# EAGLE schematic arduino_olfactometer (EAGLE 5.11)

## Sheet 1 of 4
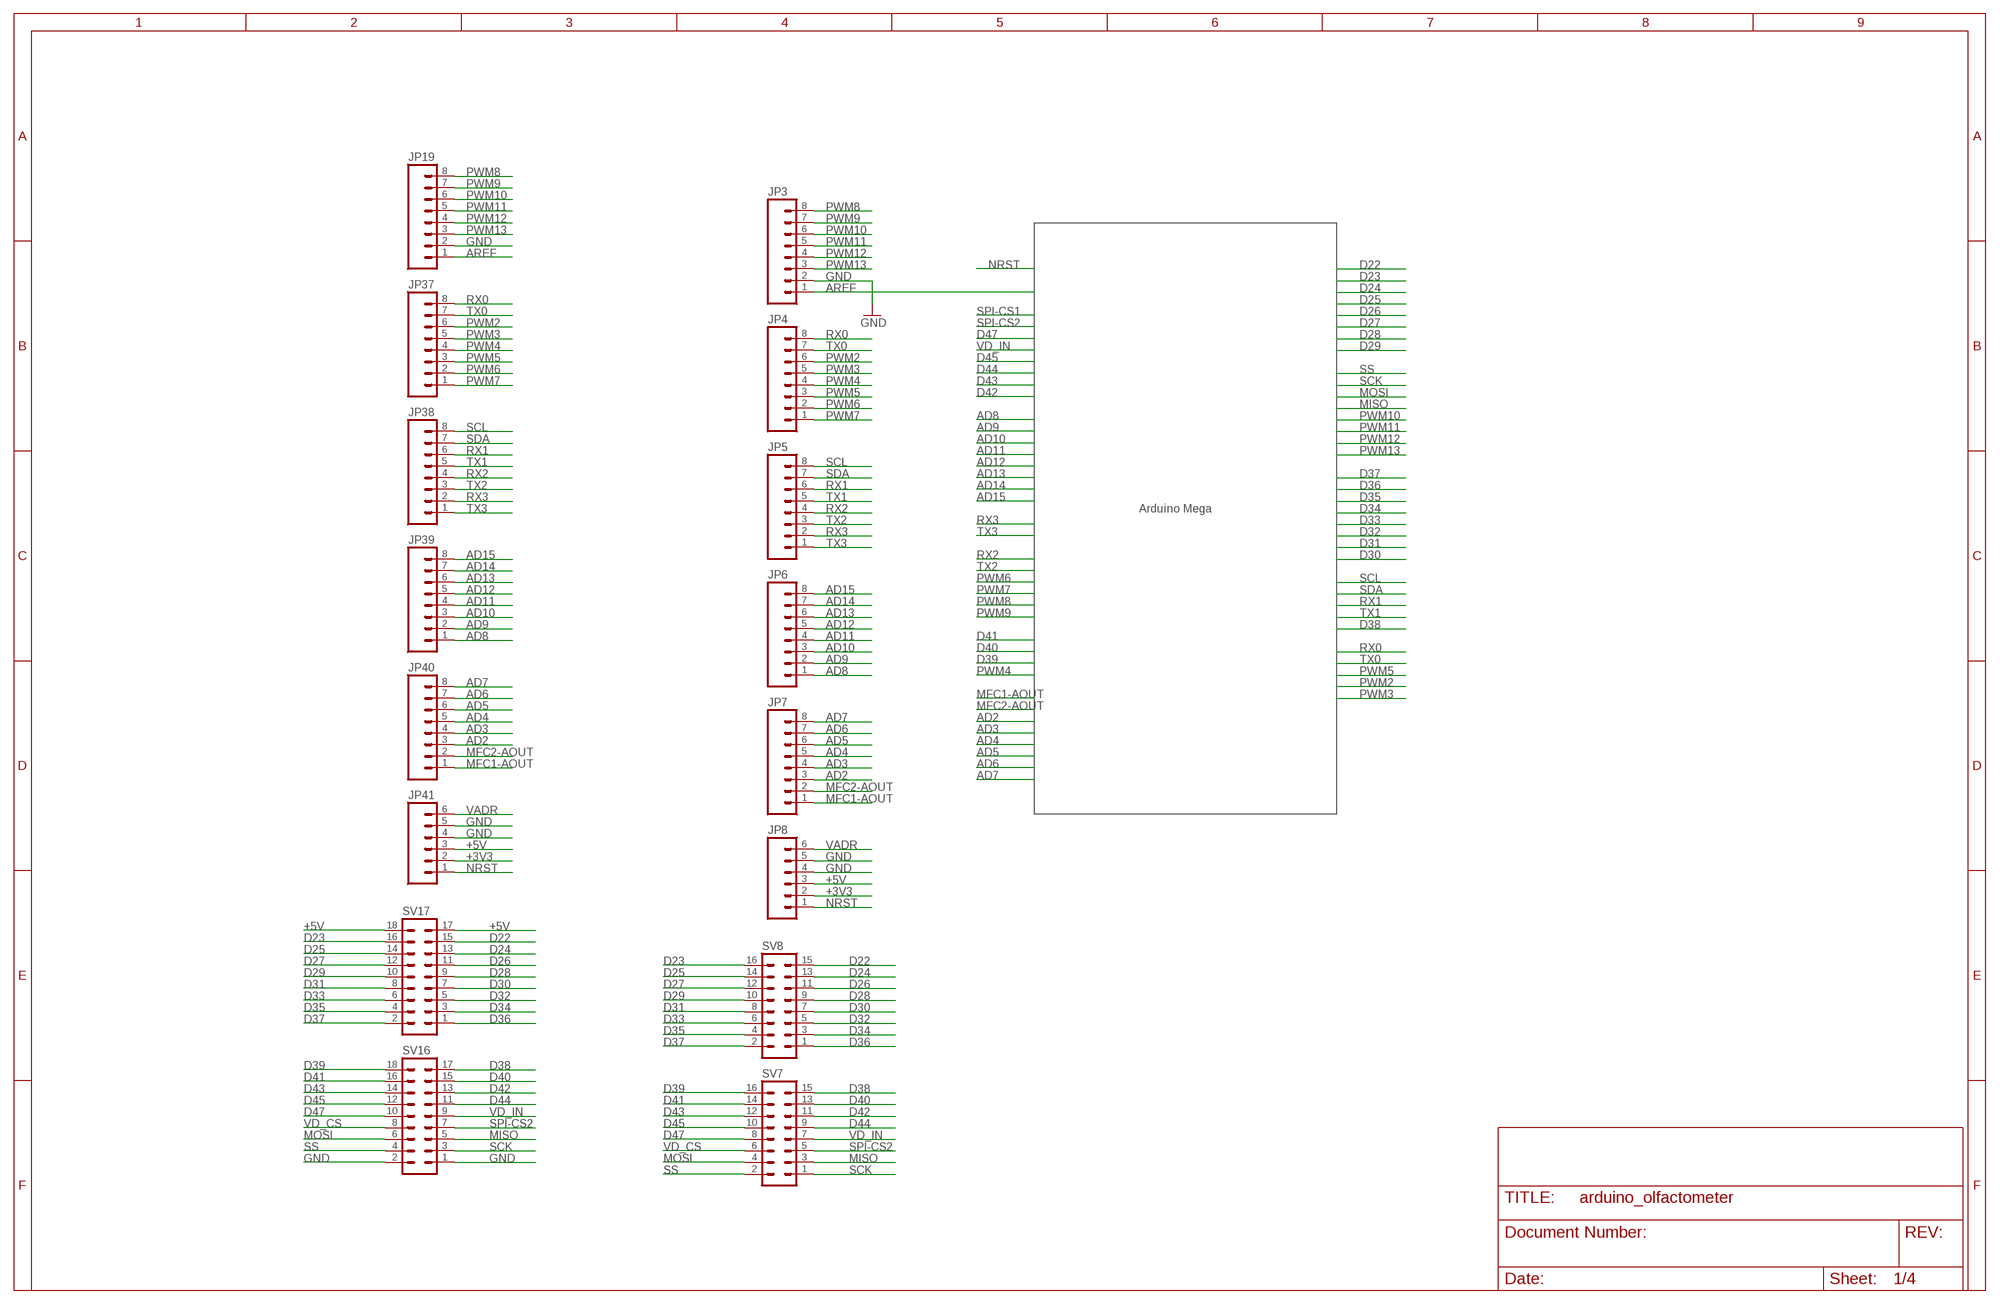
[diagram p0: schematic, sheet 1]

### Parts
JP3  M08  [1X08]
JP4  M08  [1X08]
JP5  M08  [1X08]
JP6  M08  [1X08]
JP7  M08  [1X08]
JP8  M06SIP  [1X06]
JP19  M08  [1X08]
JP37  M08  [1X08]
JP38  M08  [1X08]
JP39  M08  [1X08]
JP40  M08  [1X08]
JP41  M06SIP  [1X06]
SV7  MA08-2  [MA08-2]
SV8  MA08-2  [MA08-2]
SV16  MA09-2  [MA09-2]
SV17  MA09-2  [MA09-2]

### Nets
+3V3: JP8.2 JP41.2
+5V: JP8.3 JP41.3 SV17.17 SV17.18 ; also sheet 2,3,4
AD2: JP7.3 JP40.3
AD3: JP7.4 JP40.4
AD4: JP7.5 JP40.5
AD5: JP7.6 JP40.6
AD6: JP7.7 JP40.7
AD7: JP7.8 JP40.8
AD8: JP6.1 JP39.1
AD9: JP6.2 JP39.2
AD10: JP6.3 JP39.3
AD11: JP6.4 JP39.4
AD12: JP6.5 JP39.5
AD13: JP6.6 JP39.6
AD14: JP6.7 JP39.7
AD15: JP6.8 JP39.8
AREF: JP3.1 JP19.1
D22: SV8.15 SV17.15
D23: SV8.16 SV17.16
D24: SV8.13 SV17.13
D25: SV8.14 SV17.14
D26: SV8.11 SV17.11
D27: SV8.12 SV17.12
D28: SV8.9 SV17.9
D29: SV8.10 SV17.10
D30: SV8.7 SV17.7
D31: SV8.8 SV17.8
D32: SV8.5 SV17.5
D33: SV8.6 SV17.6
D34: SV8.3 SV17.3
D35: SV8.4 SV17.4
D36: SV8.1 SV17.1
D37: SV8.2 SV17.2
D38: SV7.15 SV16.17
D39: SV7.16 SV16.18
D40: SV7.13 SV16.15
D41: SV7.14 SV16.16
D42: SV7.11 SV16.13
D43: SV7.12 SV16.14
D44: SV7.9 SV16.11
D45: SV7.10 SV16.12
D47: SV7.8 SV16.10
GND: JP3.2 JP8.4 JP8.5 JP19.2 JP41.4 JP41.5 SV16.1 SV16.2 ; also sheet 2,3,4
MFC1-AOUT: JP7.1 JP40.1 ; also sheet 2
MFC2-AOUT: JP7.2 JP40.2 ; also sheet 2
MISO: SV7.3 SV16.5 ; also sheet 2,4
MOSI: SV7.4 SV16.6 ; also sheet 2,3
NRST: JP8.1 JP41.1 ; also sheet 3,4
PWM2: JP4.6 JP37.6 ; also sheet 2
PWM3: JP4.5 JP37.5 ; also sheet 2
PWM4: JP4.4 JP37.4 ; also sheet 2
PWM5: JP4.3 JP37.3 ; also sheet 2
PWM6: JP4.2 JP37.2 ; also sheet 2
PWM7: JP4.1 JP37.1 ; also sheet 2
PWM8: JP3.8 JP19.8 ; also sheet 2
PWM9: JP3.7 JP19.7 ; also sheet 2
PWM10: JP3.6 JP19.6 ; also sheet 2
PWM11: JP3.5 JP19.5 ; also sheet 2
PWM12: JP3.4 JP19.4 ; also sheet 2
PWM13: JP3.3 JP19.3 ; also sheet 2
RX0: JP4.8 JP37.8
RX1: JP5.6 JP38.6 ; also sheet 2
RX2: JP5.4 JP38.4 ; also sheet 2
RX3: JP5.2 JP38.2 ; also sheet 2
SCK: SV7.1 SV16.3 ; also sheet 2,3,4
SCL: JP5.8 JP38.8
SDA: JP5.7 JP38.7
SPI-CS2: SV7.5 SV16.7
SS: SV7.2 SV16.4 ; also sheet 2
TX0: JP4.7 JP37.7
TX1: JP5.5 JP38.5 ; also sheet 2
TX2: JP5.3 JP38.3 ; also sheet 2
TX3: JP5.1 JP38.1 ; also sheet 2
VADR: JP8.6 JP41.6 ; also sheet 2
VD_CS: SV7.6 SV16.8 ; also sheet 3,4
VD_IN: SV7.7 SV16.9 ; also sheet 3,4

### Notes on the sheet
- Arduino Mega

## Sheet 2 of 4
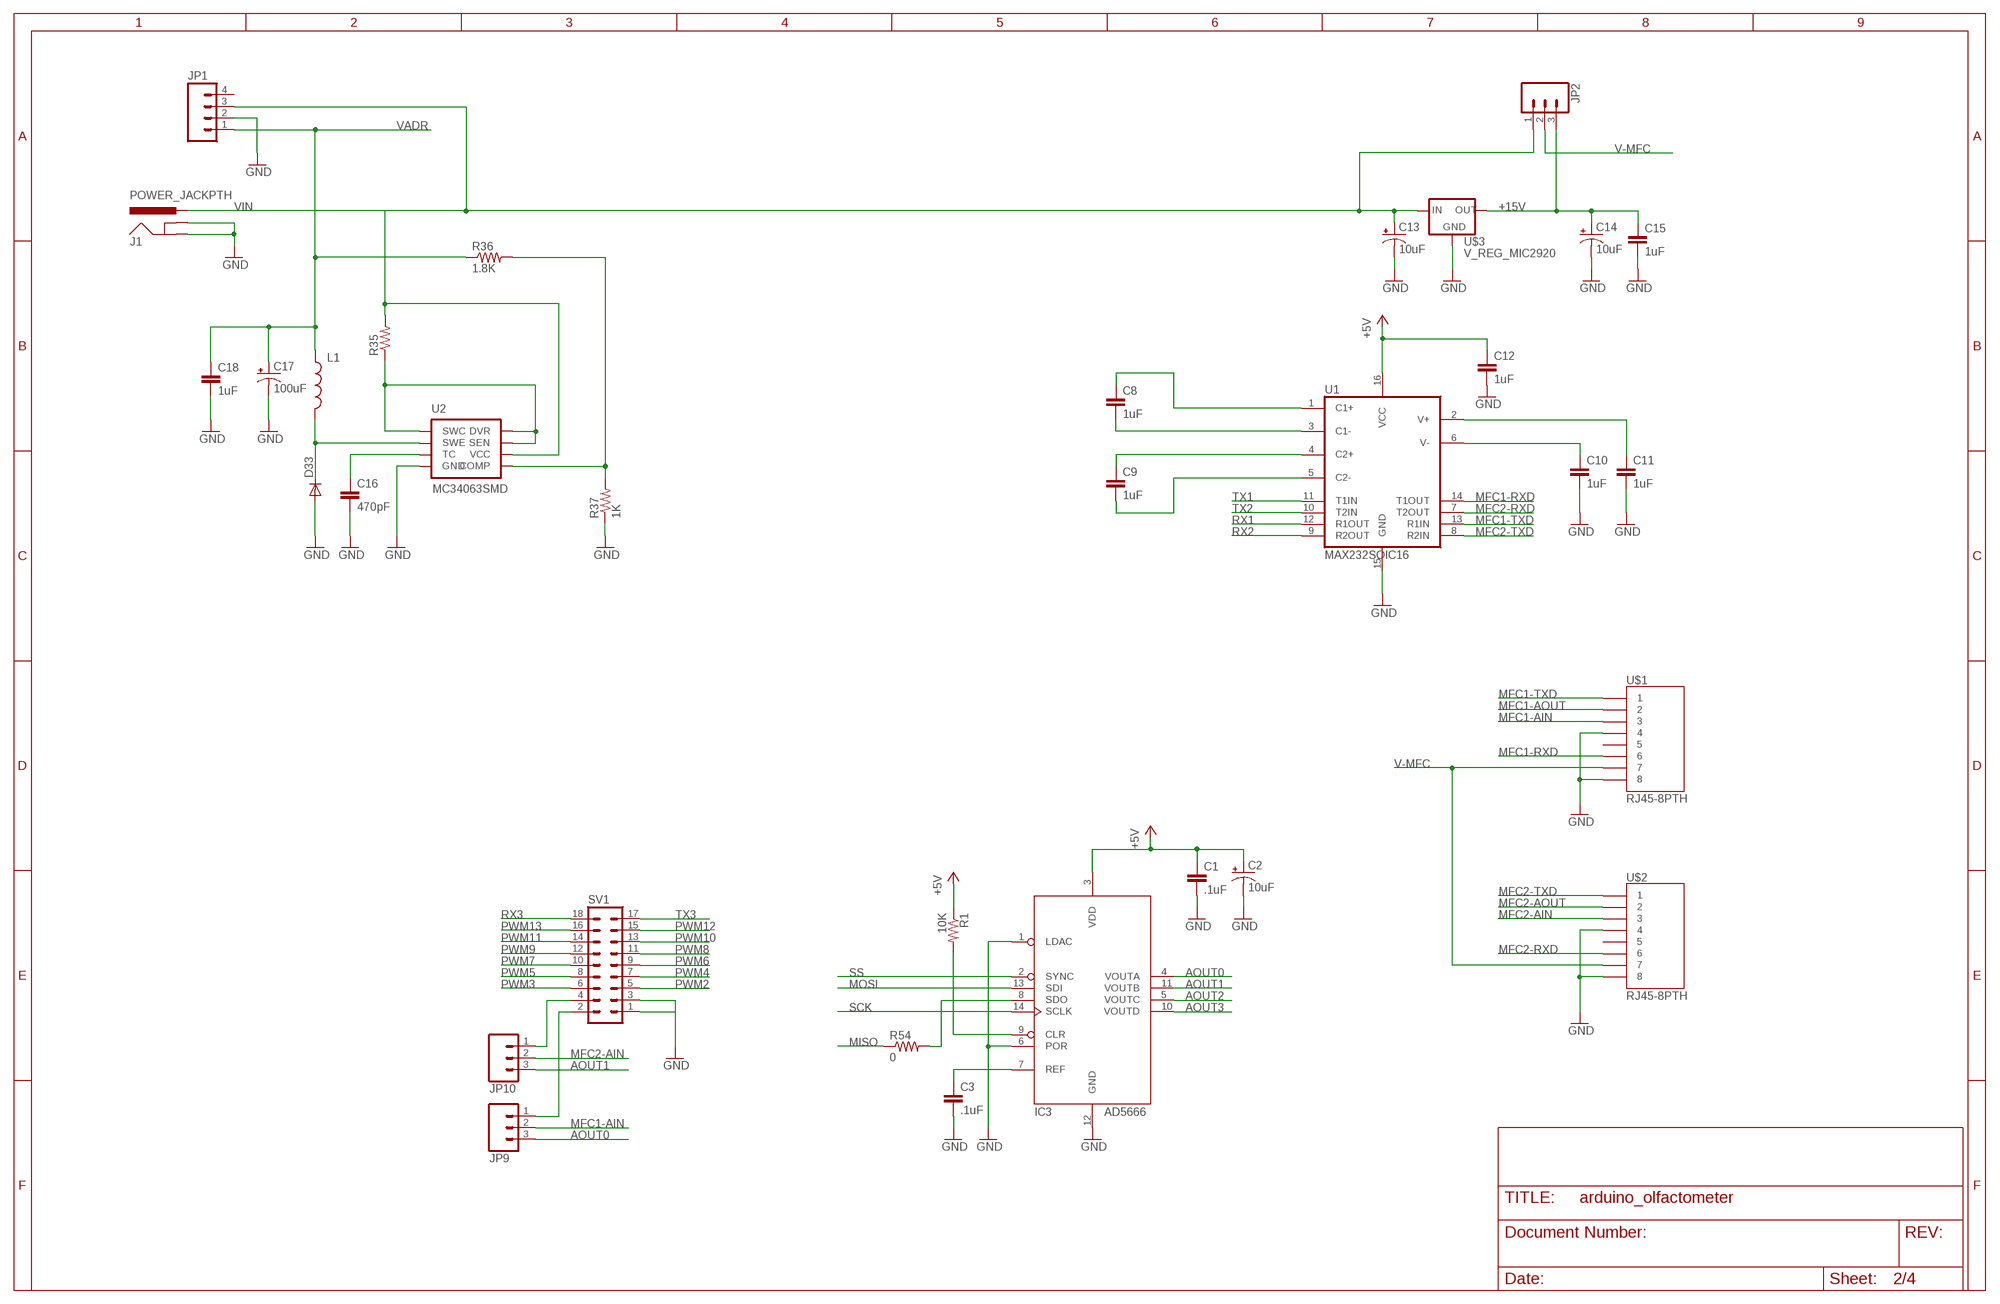
[diagram p1: schematic, sheet 2]

### Parts
C1  .1uF  CAP0603  [0603]
C2  10uF  CAP_POL1206  [EIA3216]
C3  .1uF  CAP0603  [0603]
C8  1uF  CAP0603  [0603]
C9  1uF  CAP0603  [0603]
C10  1uF  CAP0603  [0603]
C11  1uF  CAP0603  [0603]
C12  1uF  CAP0603  [0603]
C13  10uF  CAP_POL1206  [EIA3216]
C14  10uF  CAP_POL1206  [EIA3216]
C15  1uF  CAP0603  [0603]
C16  470pF  CAP0603  [0603]
C17  100uF  CAP_POLD  [PANASONIC_D]
C18  1uF  CAP0603  [0603]
D33  DIODE-SOD123  [SOD123]
IC3  AD5666  [TSSOP14]
J1  POWER_JACKPTH  [POWER_JACK_PTH]
JP1  M04PTH  [1X04]
JP2  M03PTH  [1X03]
JP9  M03PTH  [1X03]
JP10  M03PTH  [1X03]
L1  INDUCTORCR54  [CR54]
R1  10K  RESISTOR  [0805]
R35  RESISTOR  [0805]
R36  1.8K  RESISTOR  [0805]
R37  1K  RESISTOR  [0805]
R54  0  RESISTOR  [0805]
SV1  MA09-2  [MA09-2]
U1  MAX232SOIC16  [SO016]
U2  MC34063SMD  [SO08]
U$1  RJ45-8PTH  [RJ45-8]
U$2  RJ45-8PTH  [RJ45-8]
U$3  V_REG_MIC2920  [SOT223]

### Nets
+5V: C1.1 C2.A(+) C12.1 IC3.3(VDD) R1.1 U1.16(VCC) ; also sheet 1,3,4
+15V: C14.A(+) C15.1 JP2.3 U$3.3(OUT)
AOUT0: IC3.4(VOUTA) JP9.3
AOUT1: IC3.11(VOUTB) JP10.3
AOUT2: IC3.5(VOUTC)
AOUT3: IC3.10(VOUTD)
GND: C1.2 C2.C(-) C3.2 C10.2 C11.2 C12.2 C13.C(-) C14.C(-) C15.2 C16.2 C17.- C18.2 D33.A IC3.1(LDAC) IC3.6(POR) IC3.12(GND) J1.GND J1.GNDBREAK JP1.2 R37.1 SV1.1 SV1.3 U1.15(GND) U2.4(GND) U$1.4 U$1.8 U$2.4 U$2.8 U$3.2(GND) ; also sheet 1,3,4
MFC1-AIN: JP9.2 U$1.3
MFC1-AOUT: U$1.2 ; also sheet 1
MFC1-RXD: U1.14(T1OUT) U$1.6
MFC1-TXD: U1.13(R1IN) U$1.1
MFC2-AIN: JP10.2 U$2.3
MFC2-AOUT: U$2.2 ; also sheet 1
MFC2-RXD: U1.7(T2OUT) U$2.6
MFC2-TXD: U1.8(R2IN) U$2.1
MISO: R54.1 ; also sheet 1,4
MOSI: IC3.13(SDI) ; also sheet 1,3
N$1: IC3.9(CLR) R1.2
N$2: C8.2 U1.3(C1-)
N$8: C3.1 IC3.7(REF)
N$70: C8.1 U1.1(C1+)
N$71: C9.1 U1.4(C2+)
N$72: C9.2 U1.5(C2-)
N$73: C11.1 U1.2(V+)
N$74: C10.1 U1.6(V-)
N$76: JP9.1 SV1.2
N$77: JP10.1 SV1.4
N$78: R35.1 U2.1(SWC) U2.7(SEN) U2.8(DVR)
N$81: D33.C L1.P$2 U2.2(SWE)
N$82: C16.1 U2.3(TC)
N$83: R36.2 R37.2 U2.5(COMP)
N$158: IC3.8(SDO) R54.2
PWM2: SV1.5 ; also sheet 1
PWM3: SV1.6 ; also sheet 1
PWM4: SV1.7 ; also sheet 1
PWM5: SV1.8 ; also sheet 1
PWM6: SV1.9 ; also sheet 1
PWM7: SV1.10 ; also sheet 1
PWM8: SV1.11 ; also sheet 1
PWM9: SV1.12 ; also sheet 1
PWM10: SV1.13 ; also sheet 1
PWM11: SV1.14 ; also sheet 1
PWM12: SV1.15 ; also sheet 1
PWM13: SV1.16 ; also sheet 1
RX1: U1.12(R1OUT) ; also sheet 1
RX2: U1.9(R2OUT) ; also sheet 1
RX3: SV1.18 ; also sheet 1
SCK: IC3.14(SCLK) ; also sheet 1,3,4
SS: IC3.2(SYNC) ; also sheet 1
TX1: U1.11(T1IN) ; also sheet 1
TX2: U1.10(T2IN) ; also sheet 1
TX3: SV1.17 ; also sheet 1
V-MFC: JP2.2 U$1.7 U$2.7
VADR: C17.+ C18.1 JP1.1 L1.P$1 R36.1 ; also sheet 1
VIN: C13.A(+) J1.PWR JP1.3 JP2.1 R35.2 U2.6(VCC) U$3.1(IN) ; also sheet 3,4
Unconnected: JP1.4 U$1.5 U$2.5

## Sheet 3 of 4
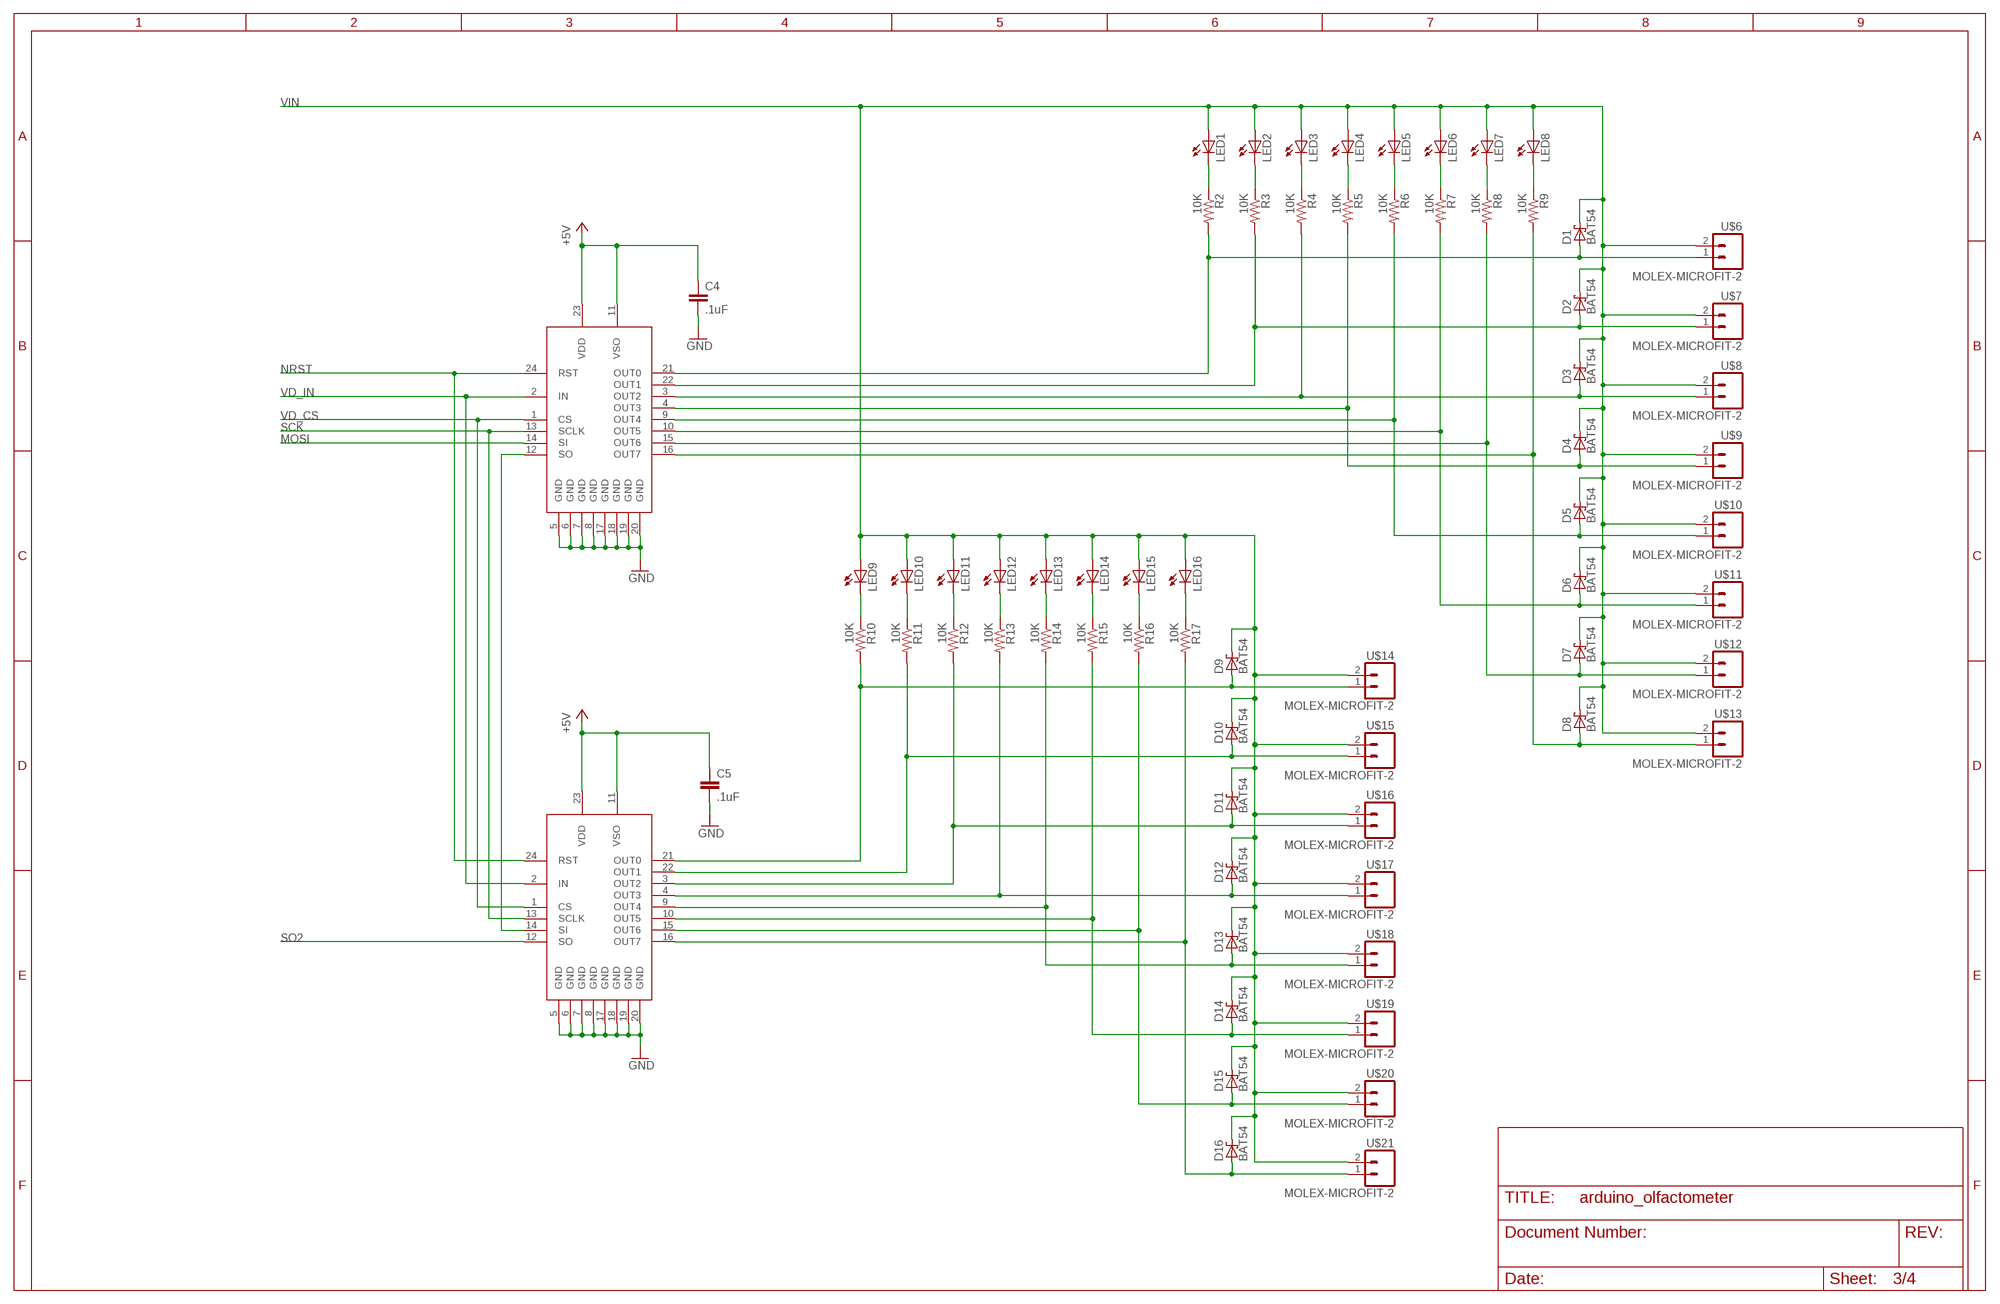
[diagram p2: schematic, sheet 3]

### Parts
C4  .1uF  CAP0603  [0603]
C5  .1uF  CAP0603  [0603]
D1  BAT54  [SOT23]
D2  BAT54  [SOT23]
D3  BAT54  [SOT23]
D4  BAT54  [SOT23]
D5  BAT54  [SOT23]
D6  BAT54  [SOT23]
D7  BAT54  [SOT23]
D8  BAT54  [SOT23]
D9  BAT54  [SOT23]
D10  BAT54  [SOT23]
D11  BAT54  [SOT23]
D12  BAT54  [SOT23]
D13  BAT54  [SOT23]
D14  BAT54  [SOT23]
D15  BAT54  [SOT23]
D16  BAT54  [SOT23]
LED1  LEDCHIP-LED0805  [CHIP-LED0805]
LED2  LEDCHIP-LED0805  [CHIP-LED0805]
LED3  LEDCHIP-LED0805  [CHIP-LED0805]
LED4  LEDCHIP-LED0805  [CHIP-LED0805]
LED5  LEDCHIP-LED0805  [CHIP-LED0805]
LED6  LEDCHIP-LED0805  [CHIP-LED0805]
LED7  LEDCHIP-LED0805  [CHIP-LED0805]
LED8  LEDCHIP-LED0805  [CHIP-LED0805]
LED9  LEDCHIP-LED0805  [CHIP-LED0805]
LED10  LEDCHIP-LED0805  [CHIP-LED0805]
LED11  LEDCHIP-LED0805  [CHIP-LED0805]
LED12  LEDCHIP-LED0805  [CHIP-LED0805]
LED13  LEDCHIP-LED0805  [CHIP-LED0805]
LED14  LEDCHIP-LED0805  [CHIP-LED0805]
LED15  LEDCHIP-LED0805  [CHIP-LED0805]
LED16  LEDCHIP-LED0805  [CHIP-LED0805]
R2  10K  RESISTOR  [0805]
R3  10K  RESISTOR  [0805]
R4  10K  RESISTOR  [0805]
R5  10K  RESISTOR  [0805]
R6  10K  RESISTOR  [0805]
R7  10K  RESISTOR  [0805]
R8  10K  RESISTOR  [0805]
R9  10K  RESISTOR  [0805]
R10  10K  RESISTOR  [0805]
R11  10K  RESISTOR  [0805]
R12  10K  RESISTOR  [0805]
R13  10K  RESISTOR  [0805]
R14  10K  RESISTOR  [0805]
R15  10K  RESISTOR  [0805]
R16  10K  RESISTOR  [0805]
R17  10K  RESISTOR  [0805]
U$4  TLE7232G  [SOP24]
U$5  TLE7232G  [SOP24]
U$6  MOLEX-MICROFIT-2  [MOLEX-MICROFIT-2]
U$7  MOLEX-MICROFIT-2  [MOLEX-MICROFIT-2]
U$8  MOLEX-MICROFIT-2  [MOLEX-MICROFIT-2]
U$9  MOLEX-MICROFIT-2  [MOLEX-MICROFIT-2]
U$10  MOLEX-MICROFIT-2  [MOLEX-MICROFIT-2]
U$11  MOLEX-MICROFIT-2  [MOLEX-MICROFIT-2]
U$12  MOLEX-MICROFIT-2  [MOLEX-MICROFIT-2]
U$13  MOLEX-MICROFIT-2  [MOLEX-MICROFIT-2]
U$14  MOLEX-MICROFIT-2  [MOLEX-MICROFIT-2]
U$15  MOLEX-MICROFIT-2  [MOLEX-MICROFIT-2]
U$16  MOLEX-MICROFIT-2  [MOLEX-MICROFIT-2]
U$17  MOLEX-MICROFIT-2  [MOLEX-MICROFIT-2]
U$18  MOLEX-MICROFIT-2  [MOLEX-MICROFIT-2]
U$19  MOLEX-MICROFIT-2  [MOLEX-MICROFIT-2]
U$20  MOLEX-MICROFIT-2  [MOLEX-MICROFIT-2]
U$21  MOLEX-MICROFIT-2  [MOLEX-MICROFIT-2]

### Nets
+5V: C4.1 C5.1 U$4.11(VSO) U$4.23(VDD) U$5.11(VSO) U$5.23(VDD) ; also sheet 1,2,4
GND: C4.2 C5.2 U$4.5(GND) U$4.6(GND) U$4.7(GND) U$4.8(GND) U$4.17(GND) U$4.18(GND) U$4.19(GND) U$4.20(GND) U$5.5(GND) U$5.6(GND) U$5.7(GND) U$5.8(GND) U$5.17(GND) U$5.18(GND) U$5.19(GND) U$5.20(GND) ; also sheet 1,2,4
MOSI: U$4.14(SI) ; also sheet 1,2
N$3: U$4.12(SO) U$5.14(SI)
N$4: D1.1(A) R2.2 U$4.21(OUT0) U$6.1
N$5: LED1.C R2.1
N$6: D2.1(A) R3.2 U$4.22(OUT1) U$7.1
N$7: D3.1(A) R4.2 U$4.3(OUT2) U$8.1
N$9: LED2.C R3.1
N$10: LED3.C R4.1
N$11: LED4.C R5.1
N$12: LED5.C R6.1
N$13: LED6.C R7.1
N$14: D4.1(A) R5.2 U$4.4(OUT3) U$9.1
N$15: D5.1(A) R6.2 U$4.9(OUT4) U$10.1
N$16: D6.1(A) R7.2 U$4.10(OUT5) U$11.1
N$17: LED7.C R8.1
N$18: LED8.C R9.1
N$19: D7.1(A) R8.2 U$4.15(OUT6) U$12.1
N$20: D8.1(A) R9.2 U$4.16(OUT7) U$13.1
N$22: D9.1(A) R10.2 U$5.21(OUT0) U$14.1
N$23: D10.1(A) R11.2 U$5.22(OUT1) U$15.1
N$24: D11.1(A) R12.2 U$5.3(OUT2) U$16.1
N$25: LED9.C R10.1
N$26: LED10.C R11.1
N$27: LED11.C R12.1
N$28: LED12.C R13.1
N$29: LED13.C R14.1
N$30: LED14.C R15.1
N$31: D12.1(A) R13.2 U$5.4(OUT3) U$17.1
N$32: D13.1(A) R14.2 U$5.9(OUT4) U$18.1
N$33: D14.1(A) R15.2 U$5.10(OUT5) U$19.1
N$34: LED15.C R16.1
N$35: LED16.C R17.1
N$36: D15.1(A) R16.2 U$5.15(OUT6) U$20.1
N$37: D16.1(A) R17.2 U$5.16(OUT7) U$21.1
NRST: U$4.24(RST) U$5.24(RST) ; also sheet 1,4
SCK: U$4.13(SCLK) U$5.13(SCLK) ; also sheet 1,2,4
SO2: U$5.12(SO) ; also sheet 4
VD_CS: U$4.1(CS) U$5.1(CS) ; also sheet 1,4
VD_IN: U$4.2(IN) U$5.2(IN) ; also sheet 1,4
VIN: D1.3(C) D2.3(C) D3.3(C) D4.3(C) D5.3(C) D6.3(C) D7.3(C) D8.3(C) D9.3(C) D10.3(C) D11.3(C) D12.3(C) D13.3(C) D14.3(C) D15.3(C) D16.3(C) LED1.A LED2.A LED3.A LED4.A LED5.A LED6.A LED7.A LED8.A LED9.A LED10.A LED11.A LED12.A LED13.A LED14.A LED15.A LED16.A U$6.2 U$7.2 U$8.2 U$9.2 U$10.2 U$11.2 U$12.2 U$13.2 U$14.2 U$15.2 U$16.2 U$17.2 U$18.2 U$19.2 U$20.2 U$21.2 ; also sheet 2,4

## Sheet 4 of 4
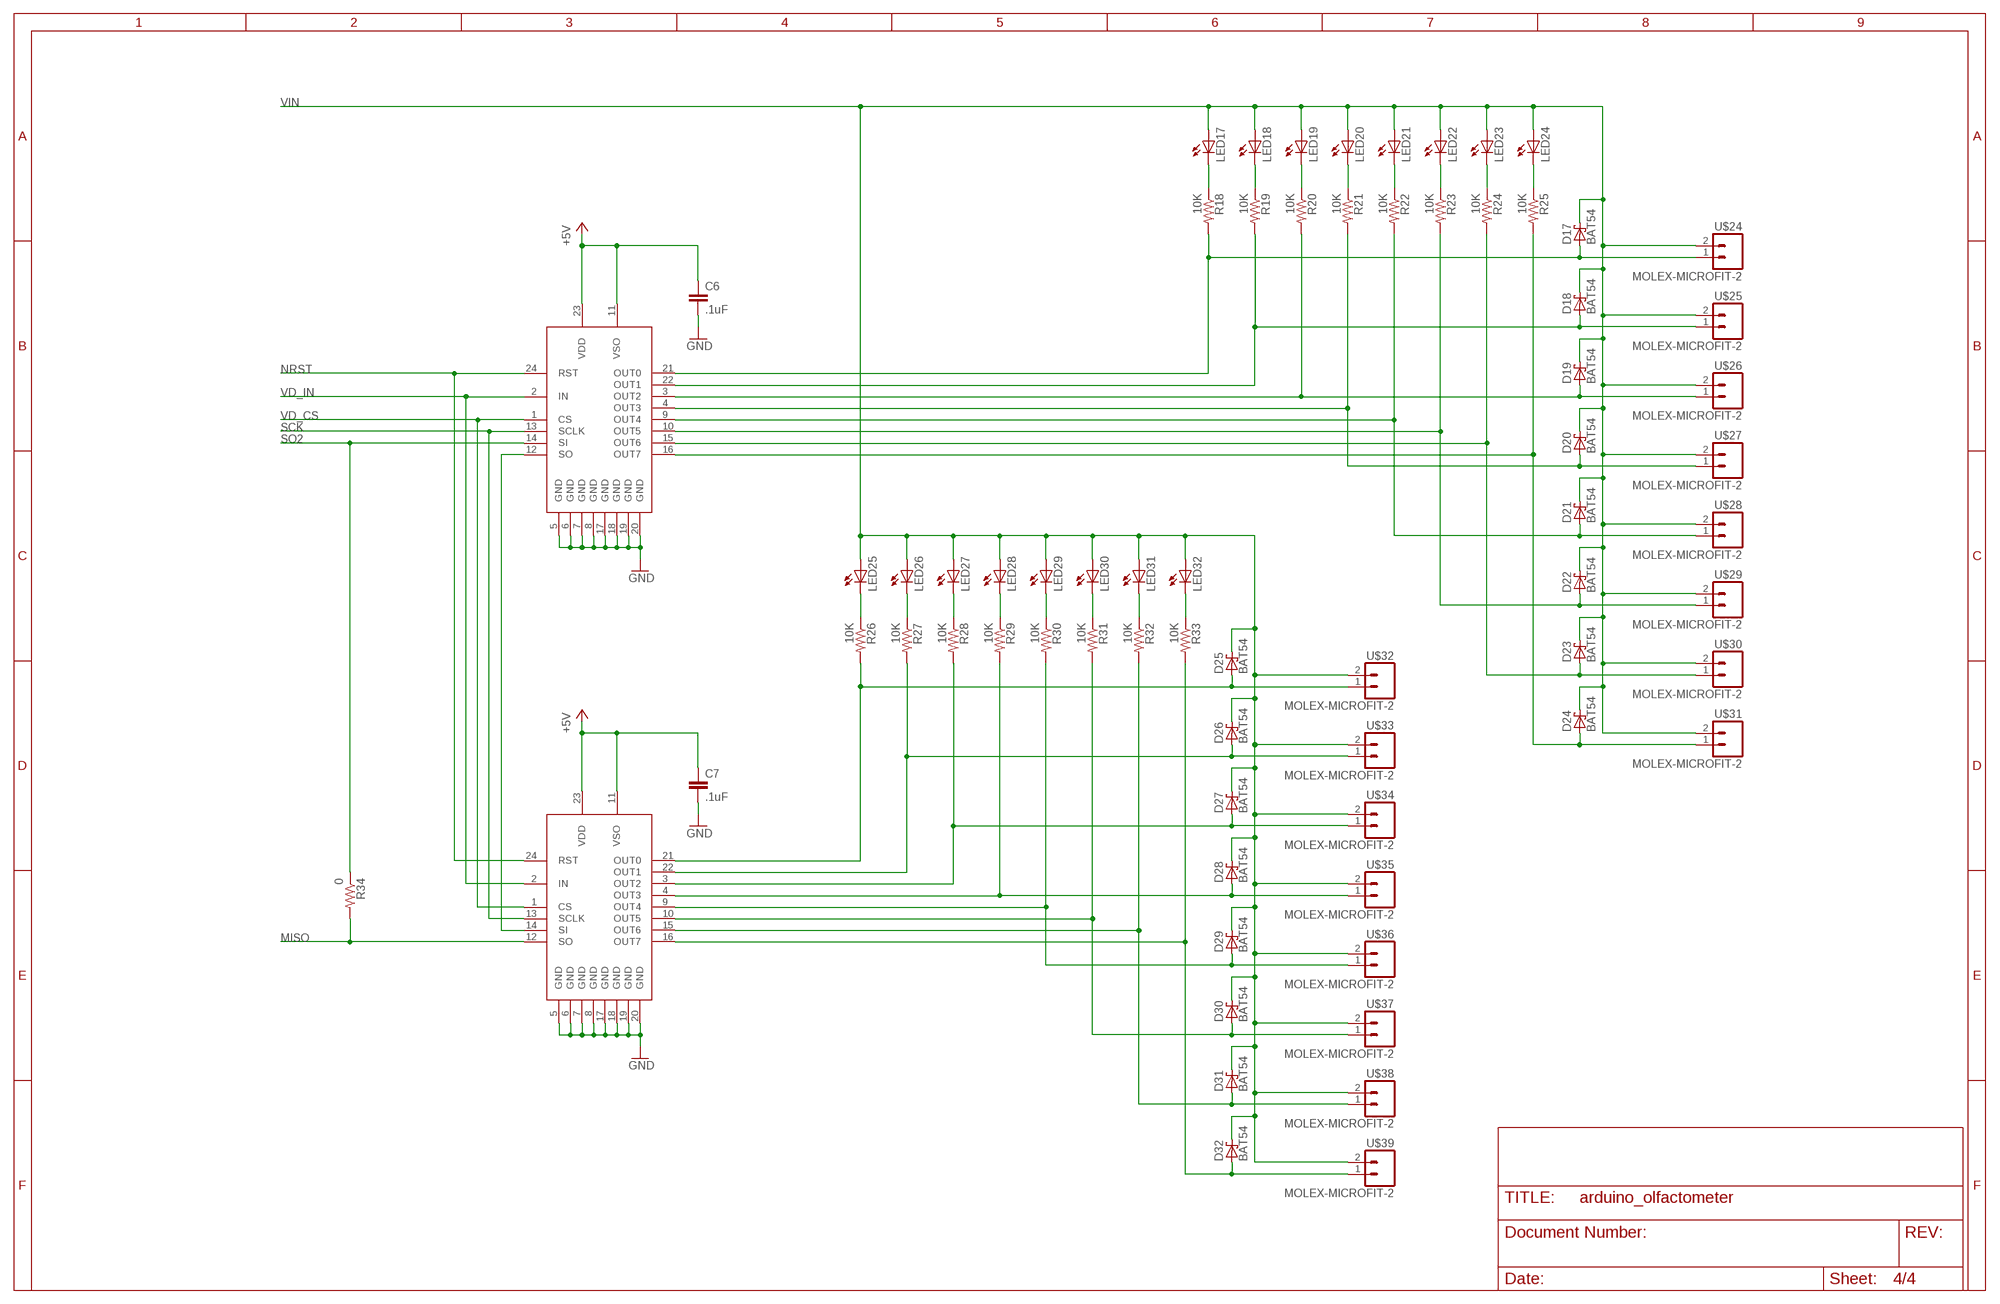
[diagram p3: schematic, sheet 4]

### Parts
C6  .1uF  CAP0603  [0603]
C7  .1uF  CAP0603  [0603]
D17  BAT54  [SOT23]
D18  BAT54  [SOT23]
D19  BAT54  [SOT23]
D20  BAT54  [SOT23]
D21  BAT54  [SOT23]
D22  BAT54  [SOT23]
D23  BAT54  [SOT23]
D24  BAT54  [SOT23]
D25  BAT54  [SOT23]
D26  BAT54  [SOT23]
D27  BAT54  [SOT23]
D28  BAT54  [SOT23]
D29  BAT54  [SOT23]
D30  BAT54  [SOT23]
D31  BAT54  [SOT23]
D32  BAT54  [SOT23]
LED17  LEDCHIP-LED0805  [CHIP-LED0805]
LED18  LEDCHIP-LED0805  [CHIP-LED0805]
LED19  LEDCHIP-LED0805  [CHIP-LED0805]
LED20  LEDCHIP-LED0805  [CHIP-LED0805]
LED21  LEDCHIP-LED0805  [CHIP-LED0805]
LED22  LEDCHIP-LED0805  [CHIP-LED0805]
LED23  LEDCHIP-LED0805  [CHIP-LED0805]
LED24  LEDCHIP-LED0805  [CHIP-LED0805]
LED25  LEDCHIP-LED0805  [CHIP-LED0805]
LED26  LEDCHIP-LED0805  [CHIP-LED0805]
LED27  LEDCHIP-LED0805  [CHIP-LED0805]
LED28  LEDCHIP-LED0805  [CHIP-LED0805]
LED29  LEDCHIP-LED0805  [CHIP-LED0805]
LED30  LEDCHIP-LED0805  [CHIP-LED0805]
LED31  LEDCHIP-LED0805  [CHIP-LED0805]
LED32  LEDCHIP-LED0805  [CHIP-LED0805]
R18  10K  RESISTOR  [0805]
R19  10K  RESISTOR  [0805]
R20  10K  RESISTOR  [0805]
R21  10K  RESISTOR  [0805]
R22  10K  RESISTOR  [0805]
R23  10K  RESISTOR  [0805]
R24  10K  RESISTOR  [0805]
R25  10K  RESISTOR  [0805]
R26  10K  RESISTOR  [0805]
R27  10K  RESISTOR  [0805]
R28  10K  RESISTOR  [0805]
R29  10K  RESISTOR  [0805]
R30  10K  RESISTOR  [0805]
R31  10K  RESISTOR  [0805]
R32  10K  RESISTOR  [0805]
R33  10K  RESISTOR  [0805]
R34  0  RESISTOR  [0805]
U$22  TLE7232G  [SOP24]
U$23  TLE7232G  [SOP24]
U$24  MOLEX-MICROFIT-2  [MOLEX-MICROFIT-2]
U$25  MOLEX-MICROFIT-2  [MOLEX-MICROFIT-2]
U$26  MOLEX-MICROFIT-2  [MOLEX-MICROFIT-2]
U$27  MOLEX-MICROFIT-2  [MOLEX-MICROFIT-2]
U$28  MOLEX-MICROFIT-2  [MOLEX-MICROFIT-2]
U$29  MOLEX-MICROFIT-2  [MOLEX-MICROFIT-2]
U$30  MOLEX-MICROFIT-2  [MOLEX-MICROFIT-2]
U$31  MOLEX-MICROFIT-2  [MOLEX-MICROFIT-2]
U$32  MOLEX-MICROFIT-2  [MOLEX-MICROFIT-2]
U$33  MOLEX-MICROFIT-2  [MOLEX-MICROFIT-2]
U$34  MOLEX-MICROFIT-2  [MOLEX-MICROFIT-2]
U$35  MOLEX-MICROFIT-2  [MOLEX-MICROFIT-2]
U$36  MOLEX-MICROFIT-2  [MOLEX-MICROFIT-2]
U$37  MOLEX-MICROFIT-2  [MOLEX-MICROFIT-2]
U$38  MOLEX-MICROFIT-2  [MOLEX-MICROFIT-2]
U$39  MOLEX-MICROFIT-2  [MOLEX-MICROFIT-2]

### Nets
+5V: C6.1 C7.1 U$22.11(VSO) U$22.23(VDD) U$23.11(VSO) U$23.23(VDD) ; also sheet 1,2,3
GND: C6.2 C7.2 U$22.5(GND) U$22.6(GND) U$22.7(GND) U$22.8(GND) U$22.17(GND) U$22.18(GND) U$22.19(GND) U$22.20(GND) U$23.5(GND) U$23.6(GND) U$23.7(GND) U$23.8(GND) U$23.17(GND) U$23.18(GND) U$23.19(GND) U$23.20(GND) ; also sheet 1,2,3
MISO: R34.2 U$23.12(SO) ; also sheet 1,2
N$21: U$22.12(SO) U$23.14(SI)
N$38: D17.1(A) R18.2 U$22.21(OUT0) U$24.1
N$39: D18.1(A) R19.2 U$22.22(OUT1) U$25.1
N$40: D19.1(A) R20.2 U$22.3(OUT2) U$26.1
N$41: LED17.C R18.1
N$42: LED18.C R19.1
N$43: LED19.C R20.1
N$44: LED20.C R21.1
N$45: LED21.C R22.1
N$46: LED22.C R23.1
N$47: D20.1(A) R21.2 U$22.4(OUT3) U$27.1
N$48: D21.1(A) R22.2 U$22.9(OUT4) U$28.1
N$49: D22.1(A) R23.2 U$22.10(OUT5) U$29.1
N$50: LED23.C R24.1
N$51: LED24.C R25.1
N$52: D23.1(A) R24.2 U$22.15(OUT6) U$30.1
N$53: D24.1(A) R25.2 U$22.16(OUT7) U$31.1
N$54: D25.1(A) R26.2 U$23.21(OUT0) U$32.1
N$55: D26.1(A) R27.2 U$23.22(OUT1) U$33.1
N$56: D27.1(A) R28.2 U$23.3(OUT2) U$34.1
N$57: LED25.C R26.1
N$58: LED26.C R27.1
N$59: LED27.C R28.1
N$60: LED28.C R29.1
N$61: LED29.C R30.1
N$62: LED30.C R31.1
N$63: D28.1(A) R29.2 U$23.4(OUT3) U$35.1
N$64: D29.1(A) R30.2 U$23.9(OUT4) U$36.1
N$65: D30.1(A) R31.2 U$23.10(OUT5) U$37.1
N$66: LED31.C R32.1
N$67: LED32.C R33.1
N$68: D31.1(A) R32.2 U$23.15(OUT6) U$38.1
N$69: D32.1(A) R33.2 U$23.16(OUT7) U$39.1
NRST: U$22.24(RST) U$23.24(RST) ; also sheet 1,3
SCK: U$22.13(SCLK) U$23.13(SCLK) ; also sheet 1,2,3
SO2: R34.1 U$22.14(SI) ; also sheet 3
VD_CS: U$22.1(CS) U$23.1(CS) ; also sheet 1,3
VD_IN: U$22.2(IN) U$23.2(IN) ; also sheet 1,3
VIN: D17.3(C) D18.3(C) D19.3(C) D20.3(C) D21.3(C) D22.3(C) D23.3(C) D24.3(C) D25.3(C) D26.3(C) D27.3(C) D28.3(C) D29.3(C) D30.3(C) D31.3(C) D32.3(C) LED17.A LED18.A LED19.A LED20.A LED21.A LED22.A LED23.A LED24.A LED25.A LED26.A LED27.A LED28.A LED29.A LED30.A LED31.A LED32.A U$24.2 U$25.2 U$26.2 U$27.2 U$28.2 U$29.2 U$30.2 U$31.2 U$32.2 U$33.2 U$34.2 U$35.2 U$36.2 U$37.2 U$38.2 U$39.2 ; also sheet 2,3

## Library data of the parts
C1 C3-C12 C15 C16 C18 = SparkFun:CAP: Capacitor Standard 0603 ceramic capacitor, and 0.1" leaded capacitor.
C2 C13 C14 C17 = SparkFun:CAP_POL: Capacitor Polarized These are standard SMD and PTH capacitors. Normally 10uF, 47uF, and 100uF in electrolytic and tantalum varieties. Always verify the external diameter of the through hole cap, it varies with capacity, voltage, and manufacturer. The EIA devices should be standard.
D1-D32 = jfrc:BAT54: Silicon Schottky Diodes General-purpose diode for high-speed switching
D33 = diode:DIODE-: DIODE
IC3 = jfrc:AD5666
J1 = SparkFun:POWER_JACK: Power Jack This is the standard 5.5mm barrel jack for power. The PTH is the most common, proven, reliable, footprint. All others are experimental. The Slot footprint only works if the mill layer is transmitted to the PCB fab house so be warned. Spark Fun Electronics SKU : PRT-00119. Mating wall wart : TOL-00298 (and others)
JP1 = SparkFun:M04: Header 4 Standard 4-pin 0.1" header. Use with straight break away headers (SKU : PRT-00116), right angle break away headers (PRT-00553), swiss pins (PRT-00743), machine pins (PRT-00117), and female headers (PRT-00115). Molex polarized connector foot print use with SKU : PRT-08231 with associated crimp pins and housings.
JP2 JP9 JP10 = SparkFun:M03: Header 3 Standard 3-pin 0.1" header. Use with straight break away headers (SKU : PRT-00116), right angle break away headers (PRT-00553), swiss pins (PRT-00743), machine pins (PRT-00117), and female headers (PRT-00115). Molex polarized connector foot print use with SKU : PRT-08232 with associated crimp pins and housings.
JP3-JP7 JP19 JP37-JP40 = jfrc:M08: Header 8 Standard 8-pin 0.1" header. Use with straight break away headers (SKU : PRT-00116), right angle break away headers (PRT-00553), swiss pins (PRT-00743), machine pins (PRT-00117), and female headers (PRT-00115).
JP8 JP41 = SparkFun:M06: Header 6 Standard 6-pin 0.1" header. Use with straight break away headers (SKU : PRT-00116), right angle break away headers (PRT-00553), swiss pins (PRT-00743), machine pins (PRT-00117), and female headers (PRT-00115). Molex polarized connector foot print use with SKU : PRT-08094 with associated crimp pins and housings. NOTES ON THE VARIANTS LOCK and LOCK_LONGPADS... This footprint was designed to help hold the alignment of a through-hole component (i.e. 6-pin header) while soldering it into place. You may notice that each hole has been shifted either up or down by 0.005 of an inch from it's more standard position (which is a perfectly straight line). This slight alteration caused the pins (the squares in the middle) to touch the edges of the holes. Because they are alternating, it causes a "brace" to hold the component in place. 0.005 has proven to be the perfect amount of "off-center" position when using our standard breakaway headers. Although looks a little odd when you look at the bare footprint, once you have a header in there, the alteration is very hard to notice. Also, if you push a header all the way into place, it is covered up entirely on the bottom side. This idea of altering the position of holes to aid alignment will be further integrated into the Sparkfun Library for other footprints. It can help hold any component with 3 or more connection pins.
L1 = SparkFun:INDUCTOR: Inductors Basic Inductor/Choke - 0603 and 1206. Footprints are not proven and vary greatly between part numbers.
LED1-LED32 = led:LED: LED OSRAM: - CHIPLED LG R971, LG N971, LY N971, LG Q971, LY Q971, LO R971, LY R971 LH N974, LH R974 LS Q976, LO Q976, LY Q976 LO Q996 - Hyper CHIPLED LW Q18S LB Q993, LB Q99A, LB R99A - SideLED LS A670, LO A670, LY A670, LG A670, LP A670 LB A673, LV A673, LT A673, LW A673 LH A674 LY A675 LS A676, LA A676, LO A676, LY A676, LW A676 LS A679, LY A679, LG A679 - Hyper Micro SIDELED® LS Y876, LA Y876, LO Y876, LY Y876 LT Y87S - SmartLED LW L88C, LW L88S LB L89C, LB L89S, LG L890 LS L89K, LO L89K, LY L89K LS L896, LA L896, LO L896, LY L896 - TOPLED LS T670, LO T670, LY T670, LG T670, LP T670 LSG T670, LSP T670, LSY T670, LOP T670, LYG T670 LG T671, LOG T671, LSG T671 LB T673, LV T673, LT T673, LW T673 LH T674 LS T676, LA T676, LO T676, LY T676, LB T676, LH T676, LSB T676, LW T676 LB T67C, LV T67C, LT T67C, LS T67K, LO T67K, LY T67K, LW E67C LS E67B, LA E67B, LO E67B, LY E67B, LB E67C, LV E67C, LT E67C LW T67C LS T679, LY T679, LG T679 LS T770, LO T770, LY T770, LG T770, LP T770 LB T773, LV T773, LT T773, LW T773 LH T774 LS E675, LA E675, LY E675, LS T675 LS T776, LA T776, LO T776, LY T776, LB T776 LHGB T686 LT T68C, LB T68C - Hyper Mini TOPLED® LB M676 - Mini TOPLED Santana® LG M470 LS M47K, LO M47K, LY M47K Source: http://www.osram.convergy.de LUXEON: - LUMILED® LXK2-PW12-R00, LXK2-PW12-S00, LXK2-PW14-U00, LXK2-PW14-V00 LXK2-PM12-R00, LXK2-PM12-S00, LXK2-PM14-U00 LXK2-PE12-Q00, LXK2-PE12-R00, LXK2-PE12-S00, LXK2-PE14-T00, LXK2-PE14-U00 LXK2-PB12-K00, LXK2-PB12-L00, LXK2-PB12-M00, LXK2-PB14-N00, LXK2-PB14-P00, LXK2-PB14-Q00 LXK2-PR12-L00, LXK2-PR12-M00, LXK2-PR14-Q00, LXK2-PR14-R00 LXK2-PD12-Q00, LXK2-PD12-R00, LXK2-PD12-S00 LXK2-PH12-R00, LXK2-PH12-S00 LXK2-PL12-P00, LXK2-PL12-Q00, LXK2-PL12-R00 Source: www.luxeon.com KINGBRIGHT: KA-3528ASYC Source: www.kingbright.com
R1-R37 R54 = SparkFun:RESISTOR: Resistor Basic schematic elements and footprints for 0603, 1206, and PTH 1/10th watt (small) resistors.
SV1 SV16 SV17 = jfrc:MA09-2: PIN HEADER
SV7 SV8 = jfrc:MA08-2: PIN HEADER
U1 = SparkFun:MAX232: RS232 Transceiver Very common IC. This is generically called 'MAX232', but works with the 3V equivalent MAX3232 generic ICs. Field tested and mother approved. Spark Fun Electronics SKU : COM-00316 (DIP) and COM-00589 (SMD)
U2 = SparkFun:MC34063
U$1 U$2 = SparkFun:RJ45-8: RJ45 Jack Simple RJ45, 8-pin connection - connector for common Cat5, Cat5e, and Cat6 Ethernet cables. Footprint not yet proven in production. Connector sku is PRT-00643; Breakout PCB sku is BOB-00716.
U$3 = SparkFun:V_REG_MIC2920: MIC2920A (http://www.micrel.com/_PDF/mic2920.pdf) - 400mA output LDO Regulator
U$4 U$5 U$22 U$23 = jfrc:TLE7232G
U$6-U$21 U$24-U$39 = jfrc:MOLEX-MICROFIT-2